# Altium schematic sheet Caps.SchDoc
size A4; SheetNumber: 1; SheetTotal: 1
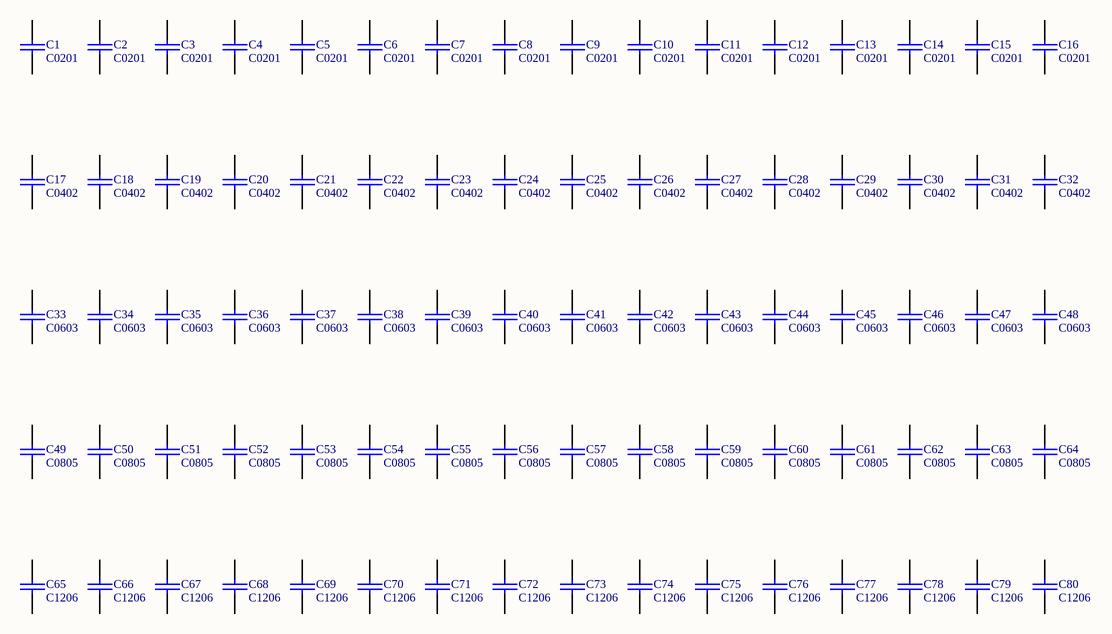
[diagram p0: Caps.SchDoc]

## Parts
C1  C0201  [C0201-paste]
C2  C0201  [C0201-paste]
C3  C0201  [C0201-paste]
C4  C0201  [C0201-paste]
C5  C0201  [C0201-paste]
C6  C0201  [C0201-paste]
C7  C0201  [C0201-paste]
C8  C0201  [C0201-paste]
C9  C0201  [C0201-paste]
C10  C0201  [C0201-paste]
C11  C0201  [C0201-paste]
C12  C0201  [C0201-paste]
C13  C0201  [C0201-paste]
C14  C0201  [C0201-paste]
C15  C0201  [C0201-paste]
C16  C0201  [C0201-paste]
C17  C0402  [C0402-Paste]
C18  C0402  [C0402-Paste]
C19  C0402  [C0402-Paste]
C20  C0402  [C0402-Paste]
C21  C0402  [C0402-Paste]
C22  C0402  [C0402-Paste]
C23  C0402  [C0402-Paste]
C24  C0402  [C0402-Paste]
C25  C0402  [C0402-Paste]
C26  C0402  [C0402-Paste]
C27  C0402  [C0402-Paste]
C28  C0402  [C0402-Paste]
C29  C0402  [C0402-Paste]
C30  C0402  [C0402-Paste]
C31  C0402  [C0402-Paste]
C32  C0402  [C0402-Paste]
C33  C0603  [C0603_PASTE]
C34  C0603  [C0603_PASTE]
C35  C0603  [C0603_PASTE]
C36  C0603  [C0603_PASTE]
C37  C0603  [C0603_PASTE]
C38  C0603  [C0603_PASTE]
C39  C0603  [C0603_PASTE]
C40  C0603  [C0603_PASTE]
C41  C0603  [C0603_PASTE]
C42  C0603  [C0603_PASTE]
C43  C0603  [C0603_PASTE]
C44  C0603  [C0603_PASTE]
C45  C0603  [C0603_PASTE]
C46  C0603  [C0603_PASTE]
C47  C0603  [C0603_PASTE]
C48  C0603  [C0603_PASTE]
C49  C0805  [C0805_Paste]
C50  C0805  [C0805_Paste]
C51  C0805  [C0805_Paste]
C52  C0805  [C0805_Paste]
C53  C0805  [C0805_Paste]
C54  C0805  [C0805_Paste]
C55  C0805  [C0805_Paste]
C56  C0805  [C0805_Paste]
C57  C0805  [C0805_Paste]
C58  C0805  [C0805_Paste]
C59  C0805  [C0805_Paste]
C60  C0805  [C0805_Paste]
C61  C0805  [C0805_Paste]
C62  C0805  [C0805_Paste]
C63  C0805  [C0805_Paste]
C64  C0805  [C0805_Paste]
C65  C1206  [C1206_PASTE]
C66  C1206  [C1206_PASTE]
C67  C1206  [C1206_PASTE]
C68  C1206  [C1206_PASTE]
C69  C1206  [C1206_PASTE]
C70  C1206  [C1206_PASTE]
C71  C1206  [C1206_PASTE]
C72  C1206  [C1206_PASTE]
C73  C1206  [C1206_PASTE]
C74  C1206  [C1206_PASTE]
C75  C1206  [C1206_PASTE]
C76  C1206  [C1206_PASTE]
C77  C1206  [C1206_PASTE]
C78  C1206  [C1206_PASTE]
C79  C1206  [C1206_PASTE]
C80  C1206  [C1206_PASTE]

## Nets

Not connected (* = marked no-connect by the designer): C1 1 2; C2 1 2; C3 1 2; C4 1 2; C5 1 2; C6 1 2; C7 1 2; C8 1 2; C9 1 2; C10 1 2; C11 1 2; C12 1 2; C13 1 2; C14 1 2; C15 1 2; C16 1 2; C17 1 2; C18 1 2; C19 1 2; C20 1 2; C21 1 2; C22 1 2; C23 1 2; C24 1 2; C25 1 2; C26 1 2; C27 1 2; C28 1 2; C29 1 2; C30 1 2; C31 1 2; C32 1 2; C33 1 2; C34 1 2; C35 1 2; C36 1 2; C37 1 2; C38 1 2; C39 1 2; C40 1 2; C41 1 2; C42 1 2; C43 1 2; C44 1 2; C45 1 2; C46 1 2; C47 1 2; C48 1 2; C49 1 2; C50 1 2; C51 1 2; C52 1 2; C53 1 2; C54 1 2; C55 1 2; C56 1 2; C57 1 2; C58 1 2; C59 1 2; C60 1 2; C61 1 2; C62 1 2; C63 1 2; C64 1 2; C65 1 2; C66 1 2; C67 1 2; C68 1 2; C69 1 2; C70 1 2; C71 1 2; C72 1 2; C73 1 2; C74 1 2; C75 1 2; C76 1 2; C77 1 2; C78 1 2; C79 1 2; C80 1 2

## Library data of the parts
C1-C16 = C-0201: Multilayer Ceramic Capacitors MLCC - SMD  0201; Value: C0201; Manufacturer: -; Manufacturer PN: -; Supplier: digikey.ca
C17-C32 = C-0402: Multilayer Ceramic Capacitors MLCC - SMD  0402; Value: C0402; Manufacturer: -; Manufacturer PN: -; Supplier: digikey.ca
C33-C48 = C-0603: Multilayer Ceramic Capacitors MLCC - SMD 0603; Value: C0603; Manufacturer: -; Manufacturer PN: -; Supplier: digikey.ca
C49-C64 = C-0805: Multilayer Ceramic Capacitors MLCC - SMD 0805; Value: C0805; Manufacturer: -; Manufacturer PN: -; Supplier: digikey.ca
C65-C80 = C-1206: Multilayer Ceramic Capacitors MLCC - SMD 1206; Value: C1206; Manufacturer: -; Manufacturer PN: -; Supplier: digikey.ca